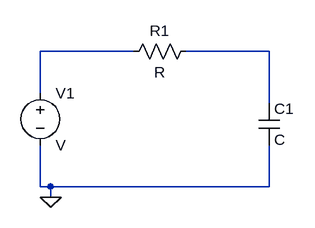
[diagram p0: schematic lowpass.asc]
lowpass.asc, the LTspice schematic file:
Version 4
SHEET 1 880 680
WIRE -528 128 -672 128
WIRE -320 128 -448 128
WIRE -672 192 -672 128
WIRE -320 208 -320 128
WIRE -672 336 -672 272
WIRE -656 336 -672 336
WIRE -320 336 -320 272
WIRE -320 336 -656 336
WIRE -656 352 -656 336
FLAG -656 352 0
SYMBOL voltage -672 176 R0
SYMATTR InstName V1
SYMBOL res -432 112 R90
WINDOW 0 0 56 VBottom 2
WINDOW 3 32 56 VTop 2
SYMATTR InstName R1
SYMBOL cap -336 208 R0
SYMATTR InstName C1

The netlist it stands for:
* lowpass.asc
V1 N001 0 V
R1 N002 N001 R
C1 N002 0 C
.backanno
.end